# Altium project LED_Indicator.PrjPcb
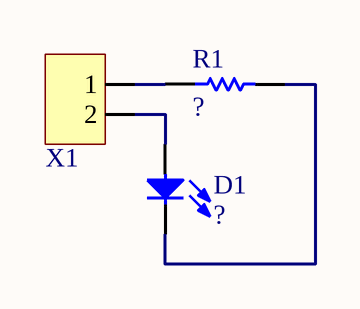
[diagram p0: LED_Indicator.SchDoc]
1 sheet, 3 parts. Net scope: global (net labels, ports and power ports of the same name join across sheets).
Board file: LED_Indicator.PcbDoc

## Sheet LED_Indicator.SchDoc
size A4; SheetNumber: 1; SheetTotal: 1

### Parts
D1  ?  [LED_2835]
R1  Resistor  [RES_0603]  (value not drawn)
X1  ?  [PAD_SMD_X2]  (value not drawn)

### Nets
NetD1_1: D1.1(A) X1.2
NetD1_2: D1.2(K) R1.2
NetR1_1: R1.1 X1.1

### Library data of the parts
D1 = Diode LED
X1 = Double connector
R1 = Resistor: Resistance: ?